# EAGLE schematic board (EAGLE 5.06)
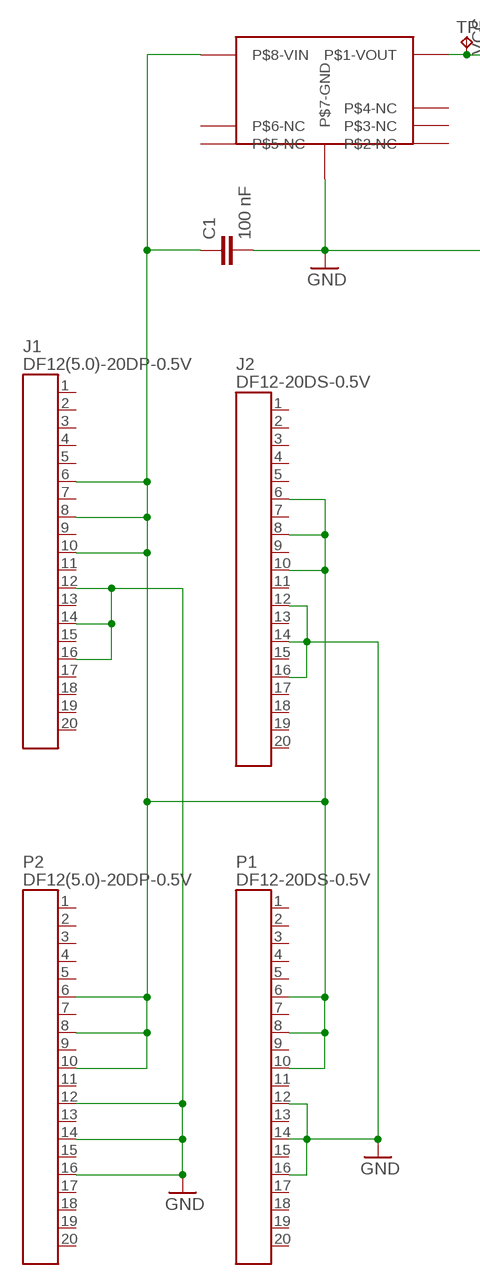
[diagram p0: schematic, sheet 1, part 1 of 2]
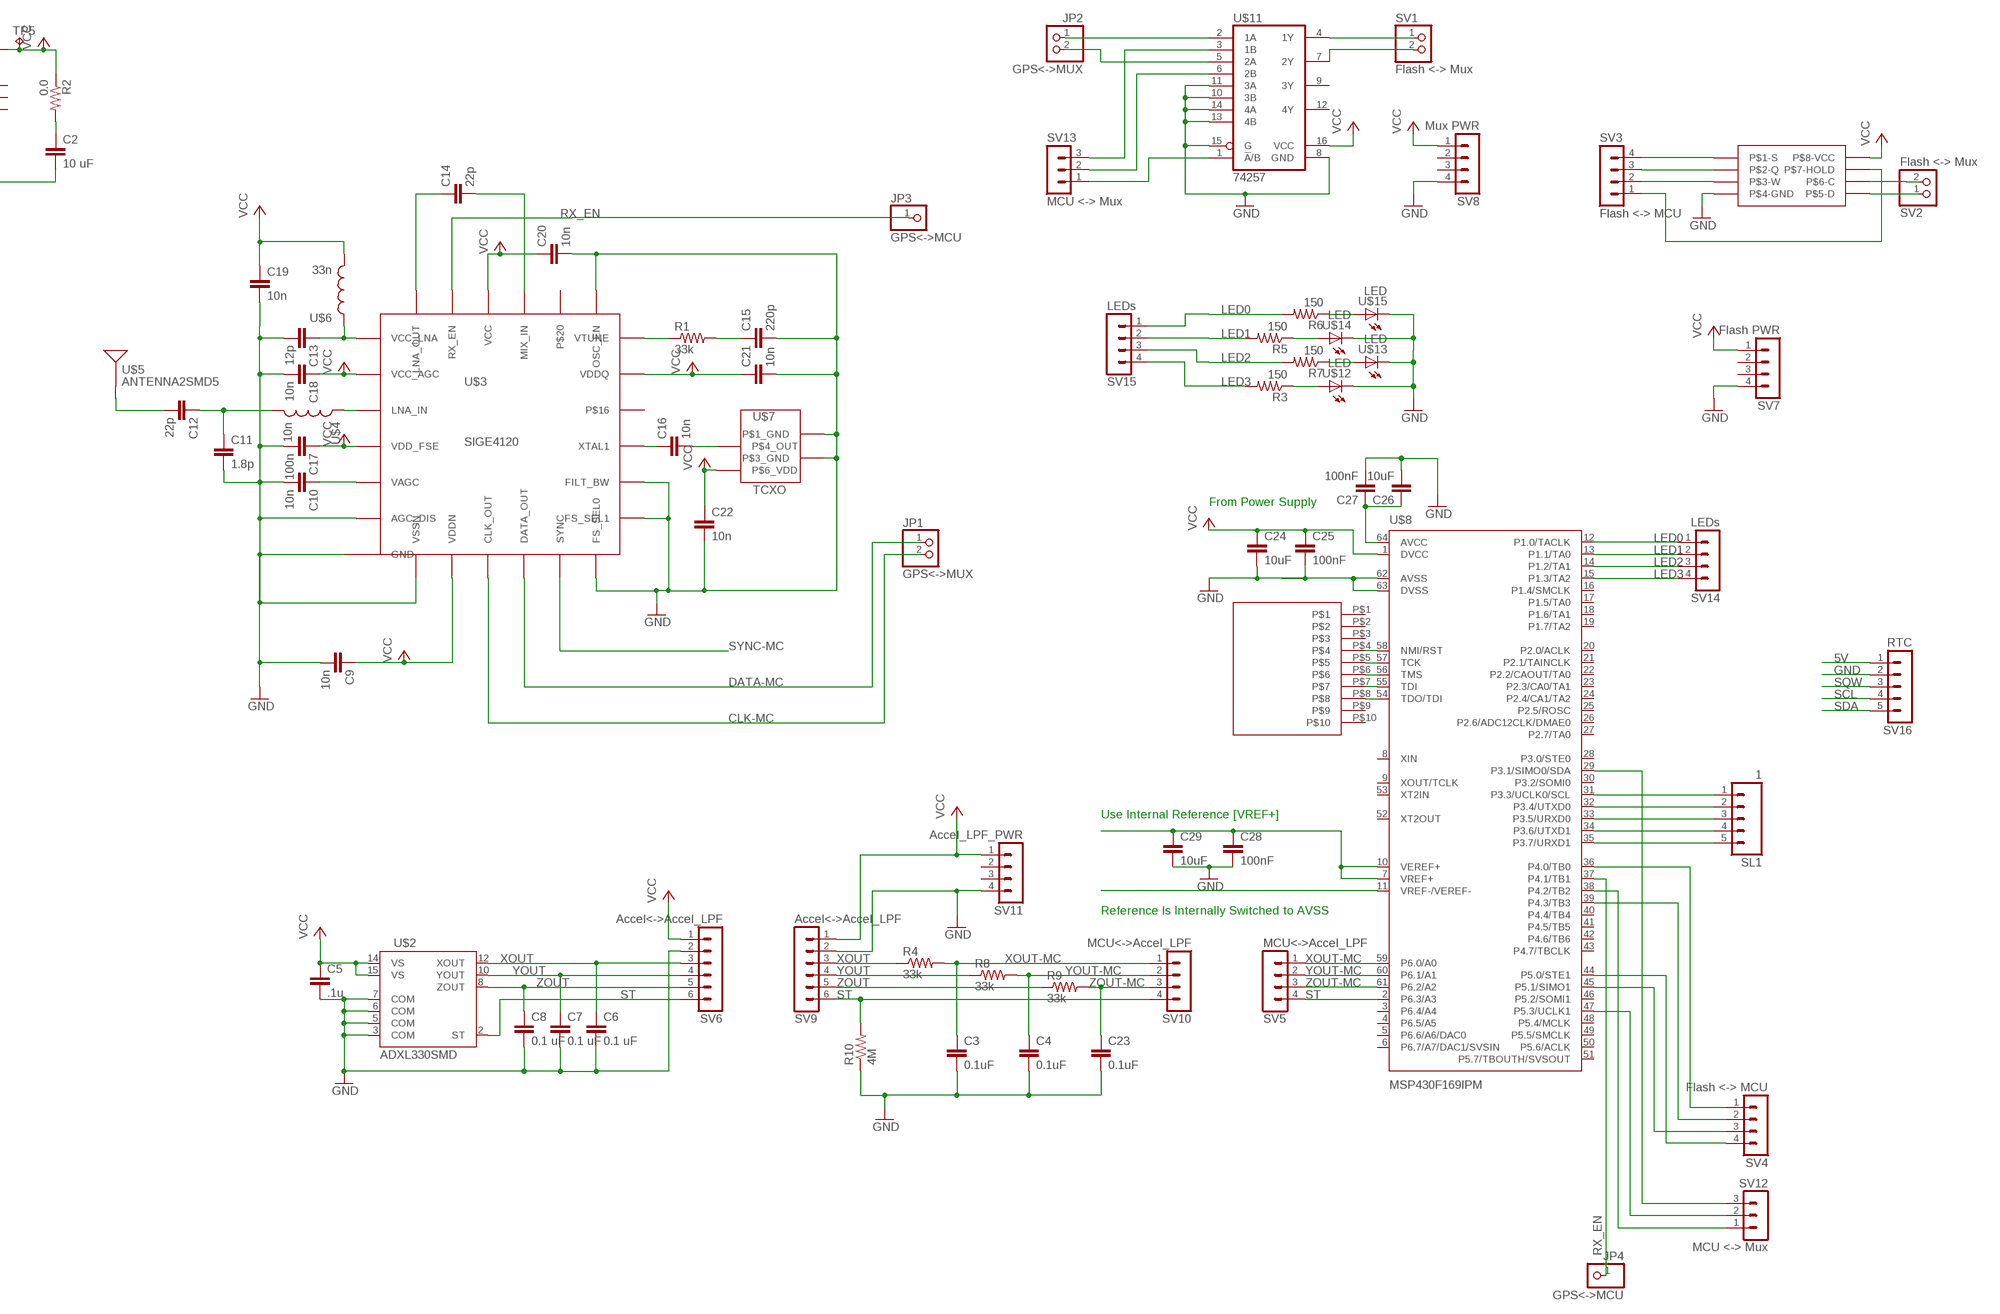
[diagram p1: schematic, sheet 1, part 2 of 2]

## Parts
C1  100 nF  CAP0402  [C0402]
C2  10 uF  CAP0402  [C0402]
C3  0.1uF  CAP0402  [C0402]
C4  0.1uF  CAP0402  [C0402]
C5  .1u  CAP0402  [C0402]
C6  0.1 uF  CAP0402  [C0402]
C7  0.1 uF  CAP0402  [C0402]
C8  0.1 uF  CAP0402  [C0402]
C9  10n  CAP0402  [C0402]
C10  10n  CAP0402  [C0402]
C11  1.8p  CAP0402  [C0402]
C12  22p  CAP0402  [C0402]
C13  12p  CAP0402  [C0402]
C14  22p  CAP0402  [C0402]
C15  220p  CAP0402  [C0402]
C16  10n  CAP0402  [C0402]
C17  100n  CAP0402  [C0402]
C18  10n  CAP0402  [C0402]
C19  10n  CAP0402  [C0402]
C20  10n  CAP0402  [C0402]
C21  10n  CAP0402  [C0402]
C22  10n  CAP0402  [C0402]
C23  0.1uF  CAP0402  [C0402]
C24  10uF  CAP0402  [C0402]
C25  100nF  CAP0402  [C0402]
C26  10uF  CAP0402  [C0402]
C27  100nF  CAP0402  [C0402]
C28  100nF  CAP0402  [C0402]
C29  10uF  CAP0402  [C0402]
J1  DF12(5.0)-20DP-0.5V  [DF12(XX)-20DP-0.5V]
J2  DF12-20DS-0.5V  [DF12-20DS-0.5V]
JP1  GPS<->MUX  PINHD-1X2  [1X02]
JP2  GPS<->MUX  PINHD-1X2  [1X02]
JP3  GPS<->MCU  PINHD-1X1  [1X01]
JP4  GPS<->MCU  PINHD-1X1  [1X01]
P1  DF12-20DS-0.5V  [DF12-20DS-0.5V]
P2  DF12(5.0)-20DP-0.5V  [DF12(XX)-20DP-0.5V]
R1  33k  RESISTOR0402  [C0402]
R2  0.0  RESISTOR  [0805]
R3  150  RESISTOR0402  [C0402]
R4  33k  RESISTOR0402  [C0402]
R5  150  RESISTOR0402  [C0402]
R6  150  RESISTOR0402  [C0402]
R7  150  RESISTOR0402  [C0402]
R8  33k  RESISTOR0402  [C0402]
R9  33k  RESISTOR0402  [C0402]
R10  4M  RESISTOR0402  [C0402]
SL1  1  M05  [1X05]
SV1  Flash <-> Mux  PINHD-1X2  [1X02]
SV2  Flash <-> Mux  PINHD-1X2  [1X02]
SV3  Flash <-> MCU  MA04-1  [MA04-1]
SV4  Flash <-> MCU  MA04-1  [MA04-1]
SV5  MCU<->Accel_LPF  MA04-1  [MA04-1]
SV6  Accel<->Accel_LPF  MA06-1  [MA06-1]
SV7  Flash PWR  MA04-1  [MA04-1]
SV8  Mux PWR  MA04-1  [MA04-1]
SV9  Accel<->Accel_LPF  MA06-1  [MA06-1]
SV10  MCU<->Accel_LPF  MA04-1  [MA04-1]
SV11  Accel_LPF_PWR  MA04-1  [MA04-1]
SV12  MCU <-> Mux  MA03-1  [MA03-1]
SV13  MCU <-> Mux  MA03-1  [MA03-1]
SV14  LEDs  MA04-1  [MA04-1]
SV15  LEDs  MA04-1  [MA04-1]
SV16  RTC  MA05-1  [MA05-1]
TP5  TPTP09SQ  [TP09SQ]
U$1  FH12A-10S-0.5SH(55)  [FH12A-10S-0.5SH(55)]
U$2  ADXL330SMD  [LFCSP-16]
U$3  SIGE4120  [SIGE4120]
U$4  10n  INDUCTOR0402  [C0402]
U$5  ANTENNA2SMD5  [ANTENNA-CHIP5]
U$6  33n  INDUCTOR0402  [C0402]
U$7  TCXO  [TXCO]
U$8  MSP430F169IPM  [S-PQFP64-G64]
U$9  M25P128  [VDFPN8]
U$10  LM2936  [8-SOIC]
U$11  74257  [16]
U$12  LED  [LED0402]
U$13  LED  [LED0402]
U$14  LED  [LED0402]
U$15  LED  [LED0402]

## Nets
5V: SV16.1
CLK-MC: JP1.2 U$3.CLK_OUT
DATA-MC: JP1.1 U$3.DATA_OUT
GND: C1.2 C2.2 C3.2 C4.2 C5.2 C6.2 C7.2 C8.2 C9.2 C10.2 C11.2 C13.2 C15.2 C17.2 C18.2 C19.2 C20.2 C21.2 C22.2 C23.2 C24.2 C25.2 C26.2 C27.2 C28.2 C29.2 J1.12 J1.14 J1.16 J2.12 J2.14 J2.16 P1.12 P1.14 P1.16 P2.12 P2.14 P2.16 R10.1 SV6.2 SV7.4 SV8.4 SV9.2 SV11.4 SV16.2 U$2.3(COM) U$2.5(COM) U$2.6(COM) U$2.7(COM) U$3.AGC_DIS U$3.FILT_BW U$3.FS_SEL0 U$3.FS_SEL1 U$3.GND U$3.OSC_EN U$3.VSSN U$7.P$1_GND U$7.P$3_GND U$8.62(AVSS) U$8.63(DVSS) U$9.P$4(P$4-GND) U$10.P$7-GND U$11.8(GND) U$11.10(3B) U$11.11(3A) U$11.13(4B) U$11.14(4A) U$11.15(G) U$12.P$2 U$13.P$2 U$14.P$2 U$15.P$2
LED0: R6.2 SV14.1 SV15.1 U$8.12(P1.0/TACLK)
LED1: R5.2 SV14.2 SV15.2 U$8.13(P1.1/TA0)
LED2: R7.2 SV14.3 SV15.3 U$8.14(P1.2/TA1)
LED3: R3.2 SV14.4 SV15.4 U$8.15(P1.3/TA2)
N$1: SV4.1 U$8.36(P4.0/TB0)
N$2: C28.1 C29.1 U$8.7(VREF+) U$8.10(VEREF+)
N$3: U$1.P$8 U$8.54(TDO/TDI)
N$4: SL1.1 U$8.31(P3.3/UCLK0/SCL)
N$5: C10.1 U$3.VAGC
N$6: SL1.2 U$8.32(P3.4/UTXD0)
N$7: U$3.LNA_IN U$4.1
N$8: C11.1 C12.1 U$4.2
N$9: C12.2 U$5.FEED(SIGNAL)
N$10: C13.1 U$3.VCC_LNA U$6.1
N$11: C14.1 U$3.LNA_OUT
N$12: C14.2 U$3.MIX_IN
N$13: R1.1 U$3.VTUNE
N$14: C15.1 R1.2
N$15: C16.1 U$3.XTAL1
N$16: C16.2 U$7.P$4_OUTPUT(P$4_OUT)
N$17: SV3.4 U$9.P$1(P$1-S)
N$18: C2.1 R2.2
N$19: U$8.11(VREF-/VEREF-)
N$20: SL1.3 U$8.33(P3.5/URXD0)
N$21: C26.1 C27.1 U$8.64(AVCC)
N$22: SL1.4 U$8.34(P3.6/UTXD1)
N$23: SL1.5 U$8.35(P3.7/URXD1)
N$24: SV4.3 U$8.45(P5.1/SIMO1)
N$25: SV4.4 U$8.44(P5.0/STE1)
N$26: SV12.1 U$8.38(P4.2/TB2)
N$27: SV2.2 U$9.P$6(P$6-C)
N$28: SV1.1 U$11.4(1Y)
N$29: SV12.2 U$8.47(P5.3/UCLK1)
N$30: SV13.3 U$11.3(1B)
N$31: U$1.P$7 U$8.55(TDI)
N$32: U$1.P$6 U$8.56(TMS)
N$33: U$1.P$5 U$8.57(TCK)
N$34: SV4.2 U$8.39(P4.3/TB3)
N$35: SV1.2 U$11.7(2Y)
N$36: U$1.P$4 U$8.58(NMI/RST)
N$37: R3.1 U$12.P$1
N$39: R5.1 U$14.P$1
N$41: R7.1 U$13.P$1
N$43: R6.1 U$15.P$1
N$44: SV2.1 U$9.P$5(P$5-D)
N$46: SV3.1 U$9.P$7(P$7-HOLD)
N$47: SV3.2 U$9.P$3(P$3-W)
N$48: C1.1 J1.6 J1.8 J1.10 J2.6 J2.8 J2.10 P1.6 P1.8 P1.10 P2.6 P2.8 P2.10 U$10.P$8-VIN
N$49: SV3.3 U$9.P$2(P$2-Q)
N$50: JP2.1 U$11.2(1A)
N$51: JP2.2 U$11.5(2A)
N$52: SV12.3 U$8.29(P3.1/SIMO0/SDA)
N$53: SV13.2 U$11.6(2B)
N$54: SV13.1 U$11.1(!A!/B)
RX_EN: JP3.1 JP4.1 U$3.RX_EN U$8.37(P4.1/TB1)
SCL: SV16.4
SDA: SV16.5
SQW: SV16.3
ST: R10.2 SV5.4 SV6.6 SV9.6 SV10.4 U$2.2(ST) U$8.2(P6.3/A3)
SYNC-MC: U$3.SYNC
VCC: C5.1 C9.1 C17.1 C18.1 C19.1 C20.1 C21.1 C22.1 C24.1 C25.1 R2.1 SV6.1 SV7.1 SV8.1 SV9.1 SV11.1 TP5.TP U$2.14(VS) U$2.15(VS) U$3.VCC U$3.VCC_AGC U$3.VDD_FSE U$3.VDDN U$3.VDDQ U$6.2 U$7.P$6_VDD U$8.1(DVCC) U$9.P$8(P$8-VCC) U$10.P$1-VOUT U$11.16(VCC)
XOUT: C6.1 R4.1 SV6.3 SV9.3 U$2.12(XOUT)
XOUT-MC: C3.1 R4.2 SV5.1 SV10.1 U$8.59(P6.0/A0)
YOUT: C7.1 R8.1 SV6.4 SV9.4 U$2.10(YOUT)
YOUT-MC: C4.1 R8.2 SV5.2 SV10.2 U$8.60(P6.1/A1)
ZOUT: C8.1 R9.1 SV6.5 SV9.5 U$2.8(ZOUT)
ZOUT-MC: C23.1 R9.2 SV5.3 SV10.3 U$8.61(P6.2/A2)
Unconnected: J1.1 J1.2 J1.3 J1.4 J1.5 J1.7 J1.9 J1.11 J1.13 J1.15 J1.17 J1.18 J1.19 J1.20 J2.1 J2.2 J2.3 J2.4 J2.5 J2.7 J2.9 J2.11 J2.13 J2.15 J2.17 J2.18 J2.19 J2.20 P1.1 P1.2 P1.3 P1.4 P1.5 P1.7 P1.9 P1.11 P1.13 P1.15 P1.17 P1.18 P1.19 P1.20 P2.1 P2.2 P2.3 P2.4 P2.5 P2.7 P2.9 P2.11 P2.13 P2.15 P2.17 P2.18 P2.19 P2.20 SV7.2 SV7.3 SV8.2 SV8.3 SV11.2 SV11.3 U$1.P$1 U$1.P$2 U$1.P$3 U$1.P$9 U$1.P$10 U$3.P$16 U$3.P$20 U$8.3(P6.4/A4) U$8.4(P6.5/A5) U$8.5(P6.6/A6/DAC0) U$8.6(P6.7/A7/DAC1/SVSIN) U$8.8(XIN) U$8.9(XOUT/TCLK) U$8.16(P1.4/SMCLK) U$8.17(P1.5/TA0) U$8.18(P1.6/TA1) U$8.19(P1.7/TA2) U$8.20(P2.0/ACLK) U$8.21(P2.1/TAINCLK) U$8.22(P2.2/CAOUT/TA0) U$8.23(P2.3/CA0/TA1) U$8.24(P2.4/CA1/TA2) U$8.25(P2.5/ROSC) U$8.26(P2.6/ADC12CLK/DMAE0) U$8.27(P2.7/TA0) U$8.28(P3.0/STE0) U$8.30(P3.2/SOMI0) U$8.40(P4.4/TB4) U$8.41(P4.5/TB5) U$8.42(P4.6/TB6) U$8.43(P4.7/TBCLK) U$8.46(P5.2/SOMI1) U$8.48(P5.4/MCLK) U$8.49(P5.5/SMCLK) U$8.50(P5.6/ACLK) U$8.51(P5.7/TBOUTH/SVSOUT) U$8.52(XT2OUT) U$8.53(XT2IN) U$10.P$2-NC U$10.P$3-NC U$10.P$4-NC U$10.P$5-NC U$10.P$6-NC U$11.9(3Y) U$11.12(4Y)

## Notes on the sheet
- From Power Supply
- Use Internal Reference [VREF+]
- Reference Is Internally Switched to AVSS

## Library data of the parts
C1-C29 = SparkFun:CAP: Capacitor Standard 0603 ceramic capacitor, and 0.1" leaded capacitor.
J1 P2 = Hirose Connectors:DF12(5.0)-20DP-0.5V: Connector, Header, board-board, 20-pin. Dual Row, 5mm stack height, 0.5mm Pitch (Hirose)
J2 P1 = Hirose Connectors:DF12-20DS-0.5V: Connector, Receptacle, board-board, 20-pin. Dual Row, 3.5 to 5mm stack height, 0.5mm Pitch (Hirose)
JP1 JP2 SV1 SV2 = pinhead:PINHD-1X2: PIN HEADER
JP3 JP4 = pinhead:PINHD-1X1: PIN HEADER
R1-R10 = SparkFun:RESISTOR: Resistor Basic schematic elements and footprints for 0603, 1206, and PTH 1/10th watt (small) resistors.
SL1 = SparkFun-3-2-07:M05: Header 5 Standard 5-pin 0.1" header. Use with straight break away headers (SKU : PType-HD), right angle break away headers (PType-HD-RightAngle), swiss pins (PType-30F), machine pins (PType-MP), and female headers (PType-FH). Molex polarized connector foot print use with SKU : Con-Hdr with associated crimp pins and housings.
SV3-SV5 SV7 SV8 SV10 SV11 SV14 SV15 = con-lstb:MA04-1: PIN HEADER
SV6 SV9 = con-lstb:MA06-1: PIN HEADER
SV12 SV13 = con-lstb:MA03-1: PIN HEADER
SV16 = con-lstb:MA05-1: PIN HEADER
TP5 = testpad:TP: Test pad
U$1 = mylib:FH12A-10S-0.5SH(55)
U$2 = SparkFun:ADXL330: Triple Axis Accelerometer Analog Devices ADXL330 +/-3g 2.4V-5.25V Analog output. Spark Fun Electronics SKU : COM-00730. Center pad paste layer has been reduced to avoid shorting.
U$3 = mylib:SIGE4120
U$4 U$6 = SparkFun:INDUCTOR: Inductors Basic Inductor/Choke - 0603 and 1206. Footprints are not proven and vary greatly between part numbers.
U$5 = SparkFun:ANTENNA2: Antenna Single endded antenna. Common with smaller chip antennas. CHIP4 package is the GPS Chip Antenna SKU: GPS-08418. CHIP5 package is 2.4GHz chip antenna SKU: WRL-00144.
U$7 = mylib:TCXO
U$8 = msp430:MSP430F16*: Mixed Signal Microcontroller 12bit ADC, 12bit DAC, I²C, USART, no LCD
U$9 = mylib:M25P128
U$10 = lm2936a:LM2936
U$11 = mylib:74257
U$12-U$15 = mylib:LED